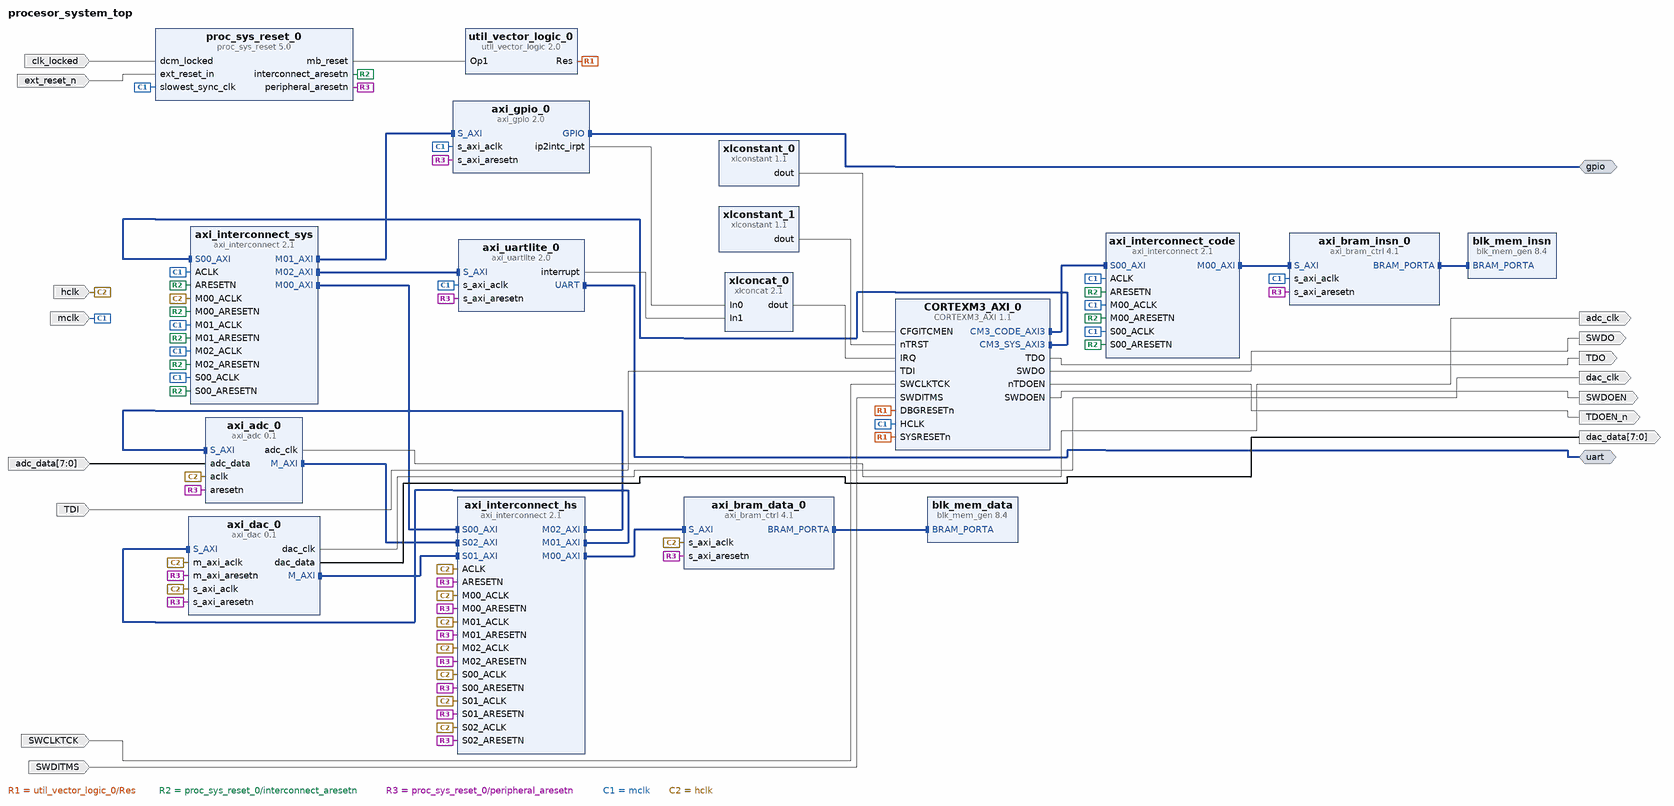
[diagram p0: block diagram of the top level]
# Vivado block design procesor_system_top, xc7z020clg400-2, Vivado 2019.1
create_bd_design procesor_system_top

create_bd_intf_port -mode Master -vlnv xilinx.com:interface:gpio_rtl:1.0 gpio
create_bd_intf_port -mode Master -vlnv xilinx.com:interface:uart_rtl:1.0 uart
create_bd_port -dir I -type clk mclk
set_property -dict {CONFIG.FREQ_HZ 50000000} [get_bd_ports mclk]
create_bd_port -dir I clk_locked
create_bd_port -dir I -type rst ext_reset_n
create_bd_port -dir I TDI
create_bd_port -dir I -type clk SWCLKTCK
set_property -dict {CONFIG.FREQ_HZ 1000000} [get_bd_ports SWCLKTCK]
create_bd_port -dir O TDO
create_bd_port -dir O TDOEN_n
create_bd_port -dir O SWDO
create_bd_port -dir O SWDOEN
create_bd_port -dir I SWDITMS
create_bd_port -dir O -type data dac_clk
create_bd_port -dir O -from 7 -to 0 dac_data
create_bd_port -dir I -type clk hclk
set_property -dict {CONFIG.CLK_DOMAIN procesor_system_top_hclk CONFIG.FREQ_HZ 150000000} [get_bd_ports hclk]
create_bd_port -dir I -from 7 -to 0 adc_data
create_bd_port -dir O -type clk adc_clk

create_bd_cell -type ip -vlnv Arm.com:CortexM:CORTEXM3_AXI:1.1 CORTEXM3_AXI_0
create_bd_cell -type ip -vlnv xilinx.com:ip:proc_sys_reset:5.0 proc_sys_reset_0
create_bd_cell -type ip -vlnv xilinx.com:ip:util_vector_logic:2.0 util_vector_logic_0
set_property -dict {CONFIG.C_OPERATION not CONFIG.C_SIZE 1} [get_bd_cells util_vector_logic_0]
create_bd_cell -type ip -vlnv xilinx.com:ip:xlconstant:1.1 xlconstant_0
set_property -dict {CONFIG.CONST_VAL b10 CONFIG.CONST_WIDTH 2} [get_bd_cells xlconstant_0]
create_bd_cell -type ip -vlnv xilinx.com:ip:axi_interconnect:2.1 axi_interconnect_sys
set_property -dict {CONFIG.ENABLE_ADVANCED_OPTIONS 1 CONFIG.NUM_MI 3} [get_bd_cells axi_interconnect_sys]
create_bd_cell -type ip -vlnv xilinx.com:ip:axi_interconnect:2.1 axi_interconnect_code
set_property -dict {CONFIG.NUM_MI 1 CONFIG.NUM_SI 1} [get_bd_cells axi_interconnect_code]
create_bd_cell -type ip -vlnv xilinx.com:ip:axi_gpio:2.0 axi_gpio_0
set_property -dict [list \
  CONFIG.C_ALL_INPUTS 0 \
  CONFIG.C_ALL_OUTPUTS 0 \
  CONFIG.C_GPIO_WIDTH 16 \
  CONFIG.C_INTERRUPT_PRESENT 1 \
] [get_bd_cells axi_gpio_0]
create_bd_cell -type ip -vlnv xilinx.com:ip:axi_bram_ctrl:4.1 axi_bram_insn_0
set_property -dict {CONFIG.RD_CMD_OPTIMIZATION 1 CONFIG.SINGLE_PORT_BRAM 1} [get_bd_cells axi_bram_insn_0]
create_bd_cell -type ip -vlnv xilinx.com:ip:xlconstant:1.1 xlconstant_1
set_property -dict {CONFIG.CONST_VAL 1} [get_bd_cells xlconstant_1]
create_bd_cell -type ip -vlnv xilinx.com:ip:blk_mem_gen:8.4 blk_mem_insn
set_property -dict [list \
  CONFIG.EN_SAFETY_CKT false \
  CONFIG.Enable_32bit_Address true \
  CONFIG.Memory_Type Single_Port_RAM \
  CONFIG.Port_B_Clock 0 \
  CONFIG.Port_B_Enable_Rate 0 \
  CONFIG.Port_B_Write_Rate 0 \
  CONFIG.Register_PortA_Output_of_Memory_Primitives false \
  CONFIG.Use_RSTA_Pin true \
  CONFIG.use_bram_block BRAM_Controller \
] [get_bd_cells blk_mem_insn]
create_bd_cell -type ip -vlnv xilinx.com:ip:axi_bram_ctrl:4.1 axi_bram_data_0
set_property -dict {CONFIG.RD_CMD_OPTIMIZATION 1 CONFIG.SINGLE_PORT_BRAM 1} [get_bd_cells axi_bram_data_0]
create_bd_cell -type ip -vlnv xilinx.com:ip:blk_mem_gen:8.4 blk_mem_data
set_property -dict {CONFIG.EN_SAFETY_CKT false} [get_bd_cells blk_mem_data]
create_bd_cell -type ip -vlnv xilinx.com:ip:axi_uartlite:2.0 axi_uartlite_0
set_property -dict [list \
  CONFIG.C_BAUDRATE 115200 \
  CONFIG.C_S_AXI_ACLK_FREQ_HZ 50000000 \
  CONFIG.C_S_AXI_ACLK_FREQ_HZ_d 50 \
] [get_bd_cells axi_uartlite_0]
create_bd_cell -type ip -vlnv xilinx.com:ip:xlconcat:2.1 xlconcat_0
create_bd_cell -type ip -vlnv xilinx.com:ip:axi_interconnect:2.1 axi_interconnect_hs
set_property -dict {CONFIG.NUM_MI 3 CONFIG.NUM_SI 3} [get_bd_cells axi_interconnect_hs]
create_bd_cell -type ip -vlnv Donlon:user:axi_adc:0.1 axi_adc_0
create_bd_cell -type ip -vlnv Donlon:user:axi_dac:0.1 axi_dac_0

# ---- connections ----

connect_bd_intf_net [get_bd_intf_pins axi_interconnect_sys/M00_AXI] [get_bd_intf_pins axi_interconnect_hs/S00_AXI]
connect_bd_intf_net [get_bd_intf_pins axi_adc_0/M_AXI] [get_bd_intf_pins axi_interconnect_hs/S02_AXI]
connect_bd_intf_net -intf_net axi_interconnect_0_M01_AXI1 [get_bd_intf_pins axi_interconnect_hs/M01_AXI] [get_bd_intf_pins axi_dac_0/S_AXI]
connect_bd_intf_net -intf_net axi_bram_ctrl_0_BRAM_PORTA [get_bd_intf_pins axi_bram_insn_0/BRAM_PORTA] [get_bd_intf_pins blk_mem_insn/BRAM_PORTA]
connect_bd_intf_net [get_bd_intf_pins axi_bram_data_0/BRAM_PORTA] [get_bd_intf_pins blk_mem_data/BRAM_PORTA]
connect_bd_intf_net [get_bd_intf_pins axi_dac_0/M_AXI] [get_bd_intf_pins axi_interconnect_hs/S01_AXI]
connect_bd_intf_net [get_bd_intf_pins axi_interconnect_hs/M02_AXI] [get_bd_intf_pins axi_adc_0/S_AXI]
connect_bd_intf_net [get_bd_intf_ports gpio] [get_bd_intf_pins axi_gpio_0/GPIO]
connect_bd_intf_net [get_bd_intf_pins CORTEXM3_AXI_0/CM3_CODE_AXI3] [get_bd_intf_pins axi_interconnect_code/S00_AXI]
connect_bd_intf_net [get_bd_intf_pins CORTEXM3_AXI_0/CM3_SYS_AXI3] [get_bd_intf_pins axi_interconnect_sys/S00_AXI]
connect_bd_intf_net -intf_net axi_interconnect_0_M01_AXI [get_bd_intf_pins axi_interconnect_sys/M01_AXI] [get_bd_intf_pins axi_gpio_0/S_AXI]
connect_bd_intf_net -intf_net axi_interconnect_0_M00_AXI [get_bd_intf_pins axi_bram_data_0/S_AXI] [get_bd_intf_pins axi_interconnect_hs/M00_AXI]
connect_bd_intf_net -intf_net axi_interconnect_1_M00_AXI [get_bd_intf_pins axi_interconnect_code/M00_AXI] [get_bd_intf_pins axi_bram_insn_0/S_AXI]
connect_bd_intf_net -intf_net axi_interconnect_0_M02_AXI [get_bd_intf_pins axi_interconnect_sys/M02_AXI] [get_bd_intf_pins axi_uartlite_0/S_AXI]
connect_bd_intf_net [get_bd_intf_ports uart] [get_bd_intf_pins axi_uartlite_0/UART]
connect_bd_net [get_bd_pins util_vector_logic_0/Res] [get_bd_pins CORTEXM3_AXI_0/SYSRESETn] [get_bd_pins CORTEXM3_AXI_0/DBGRESETn]
connect_bd_net [get_bd_pins xlconstant_0/dout] [get_bd_pins CORTEXM3_AXI_0/CFGITCMEN]
connect_bd_net -net M01_ARESETN_1 [get_bd_pins proc_sys_reset_0/interconnect_aresetn] \
  [get_bd_pins axi_interconnect_code/M00_ARESETN] [get_bd_pins axi_interconnect_code/S00_ARESETN] \
  [get_bd_pins axi_interconnect_sys/ARESETN] [get_bd_pins axi_interconnect_sys/S00_ARESETN] \
  [get_bd_pins axi_interconnect_sys/M00_ARESETN] [get_bd_pins axi_interconnect_sys/M01_ARESETN] \
  [get_bd_pins axi_interconnect_code/ARESETN] [get_bd_pins axi_interconnect_sys/M02_ARESETN]
connect_bd_net [get_bd_ports clk_locked] [get_bd_pins proc_sys_reset_0/dcm_locked]
connect_bd_net [get_bd_ports ext_reset_n] [get_bd_pins proc_sys_reset_0/ext_reset_in]
connect_bd_net [get_bd_pins proc_sys_reset_0/peripheral_aresetn] \
  [get_bd_pins axi_gpio_0/s_axi_aresetn] [get_bd_pins axi_bram_insn_0/s_axi_aresetn] \
  [get_bd_pins axi_bram_data_0/s_axi_aresetn] [get_bd_pins axi_uartlite_0/s_axi_aresetn] \
  [get_bd_pins axi_interconnect_hs/ARESETN] [get_bd_pins axi_interconnect_hs/M02_ARESETN] \
  [get_bd_pins axi_interconnect_hs/S02_ARESETN] [get_bd_pins axi_interconnect_hs/S01_ARESETN] \
  [get_bd_pins axi_interconnect_hs/M01_ARESETN] [get_bd_pins axi_interconnect_hs/M00_ARESETN] \
  [get_bd_pins axi_interconnect_hs/S00_ARESETN] [get_bd_pins axi_adc_0/aresetn] [get_bd_pins axi_dac_0/m_axi_aresetn] \
  [get_bd_pins axi_dac_0/s_axi_aresetn]
connect_bd_net [get_bd_ports TDI] [get_bd_pins CORTEXM3_AXI_0/TDI]
connect_bd_net [get_bd_ports SWCLKTCK] [get_bd_pins CORTEXM3_AXI_0/SWCLKTCK]
connect_bd_net [get_bd_pins CORTEXM3_AXI_0/TDO] [get_bd_ports TDO]
connect_bd_net [get_bd_pins CORTEXM3_AXI_0/nTDOEN] [get_bd_ports TDOEN_n]
connect_bd_net [get_bd_pins CORTEXM3_AXI_0/SWDO] [get_bd_ports SWDO]
connect_bd_net [get_bd_pins CORTEXM3_AXI_0/SWDOEN] [get_bd_ports SWDOEN]
connect_bd_net [get_bd_ports SWDITMS] [get_bd_pins CORTEXM3_AXI_0/SWDITMS]
connect_bd_net [get_bd_pins proc_sys_reset_0/mb_reset] [get_bd_pins util_vector_logic_0/Op1]
connect_bd_net [get_bd_pins xlconstant_1/dout] [get_bd_pins CORTEXM3_AXI_0/nTRST]
connect_bd_net [get_bd_pins axi_dac_0/dac_clk] [get_bd_ports dac_clk]
connect_bd_net [get_bd_pins axi_dac_0/dac_data] [get_bd_ports dac_data]
connect_bd_net [get_bd_pins xlconcat_0/dout] [get_bd_pins CORTEXM3_AXI_0/IRQ]
connect_bd_net [get_bd_pins axi_uartlite_0/interrupt] [get_bd_pins xlconcat_0/In1]
connect_bd_net [get_bd_pins axi_gpio_0/ip2intc_irpt] [get_bd_pins xlconcat_0/In0]
connect_bd_net -net HCLK_1 [get_bd_ports mclk] \
  [get_bd_pins CORTEXM3_AXI_0/HCLK] [get_bd_pins axi_interconnect_sys/ACLK] [get_bd_pins axi_interconnect_sys/S00_ACLK] \
  [get_bd_pins axi_interconnect_sys/M01_ACLK] [get_bd_pins proc_sys_reset_0/slowest_sync_clk] \
  [get_bd_pins axi_gpio_0/s_axi_aclk] [get_bd_pins axi_uartlite_0/s_axi_aclk] [get_bd_pins axi_interconnect_code/ACLK] \
  [get_bd_pins axi_interconnect_code/S00_ACLK] [get_bd_pins axi_interconnect_sys/M02_ACLK] \
  [get_bd_pins axi_interconnect_code/M00_ACLK] [get_bd_pins axi_bram_insn_0/s_axi_aclk]
connect_bd_net -net clk_300M_1 [get_bd_ports hclk] \
  [get_bd_pins axi_bram_data_0/s_axi_aclk] [get_bd_pins axi_interconnect_sys/M00_ACLK] [get_bd_pins axi_interconnect_hs/ACLK] \
  [get_bd_pins axi_interconnect_hs/S00_ACLK] [get_bd_pins axi_interconnect_hs/M00_ACLK] \
  [get_bd_pins axi_interconnect_hs/M01_ACLK] [get_bd_pins axi_interconnect_hs/S01_ACLK] \
  [get_bd_pins axi_interconnect_hs/S02_ACLK] [get_bd_pins axi_interconnect_hs/M02_ACLK] [get_bd_pins axi_adc_0/aclk] \
  [get_bd_pins axi_dac_0/m_axi_aclk] [get_bd_pins axi_dac_0/s_axi_aclk]
connect_bd_net [get_bd_pins axi_adc_0/adc_clk] [get_bd_ports adc_clk]
connect_bd_net [get_bd_ports adc_data] [get_bd_pins axi_adc_0/adc_data]

# ---- address map ----
assign_bd_address -offset 0x60000000 -range 32K -target_address_space [get_bd_addr_spaces axi_adc_0/M_AXI] [get_bd_addr_segs axi_bram_data_0/S_AXI/Mem0]
exclude_bd_addr_seg -offset 0x40200000 -range 64K -target_address_space [get_bd_addr_spaces axi_adc_0/M_AXI] [get_bd_addr_segs axi_dac_0/S_AXI/S_AXI_reg]
exclude_bd_addr_seg -offset 0x40300000 -range 64K -target_address_space [get_bd_addr_spaces axi_adc_0/M_AXI] [get_bd_addr_segs axi_adc_0/S_AXI/S_AXI_reg]
assign_bd_address -offset 0x60000000 -range 32K -target_address_space [get_bd_addr_spaces axi_dac_0/M_AXI] [get_bd_addr_segs axi_bram_data_0/S_AXI/Mem0]
exclude_bd_addr_seg -offset 0x40200000 -range 64K -target_address_space [get_bd_addr_spaces axi_dac_0/M_AXI] [get_bd_addr_segs axi_dac_0/S_AXI/S_AXI_reg]
exclude_bd_addr_seg -offset 0x40300000 -range 64K -target_address_space [get_bd_addr_spaces axi_dac_0/M_AXI] [get_bd_addr_segs axi_adc_0/S_AXI/S_AXI_reg]
assign_bd_address -offset 0x00000000 -range 32K -target_address_space [get_bd_addr_spaces CORTEXM3_AXI_0/CM3_CODE_AXI3] [get_bd_addr_segs axi_bram_insn_0/S_AXI/Mem0]
assign_bd_address -offset 0x40100000 -range 64K -target_address_space [get_bd_addr_spaces CORTEXM3_AXI_0/CM3_SYS_AXI3] [get_bd_addr_segs axi_gpio_0/S_AXI/Reg]
assign_bd_address -offset 0x40200000 -range 64K -target_address_space [get_bd_addr_spaces CORTEXM3_AXI_0/CM3_SYS_AXI3] [get_bd_addr_segs axi_dac_0/S_AXI/S_AXI_reg]
assign_bd_address -offset 0x40300000 -range 64K -target_address_space [get_bd_addr_spaces CORTEXM3_AXI_0/CM3_SYS_AXI3] [get_bd_addr_segs axi_adc_0/S_AXI/S_AXI_reg]
assign_bd_address -offset 0x40400000 -range 64K -target_address_space [get_bd_addr_spaces CORTEXM3_AXI_0/CM3_SYS_AXI3] [get_bd_addr_segs axi_uartlite_0/S_AXI/Reg]
assign_bd_address -offset 0x60000000 -range 32K -target_address_space [get_bd_addr_spaces CORTEXM3_AXI_0/CM3_SYS_AXI3] [get_bd_addr_segs axi_bram_data_0/S_AXI/Mem0]

validate_bd_design
save_bd_design
